# EAGLE design lf (EAGLE 5.11)
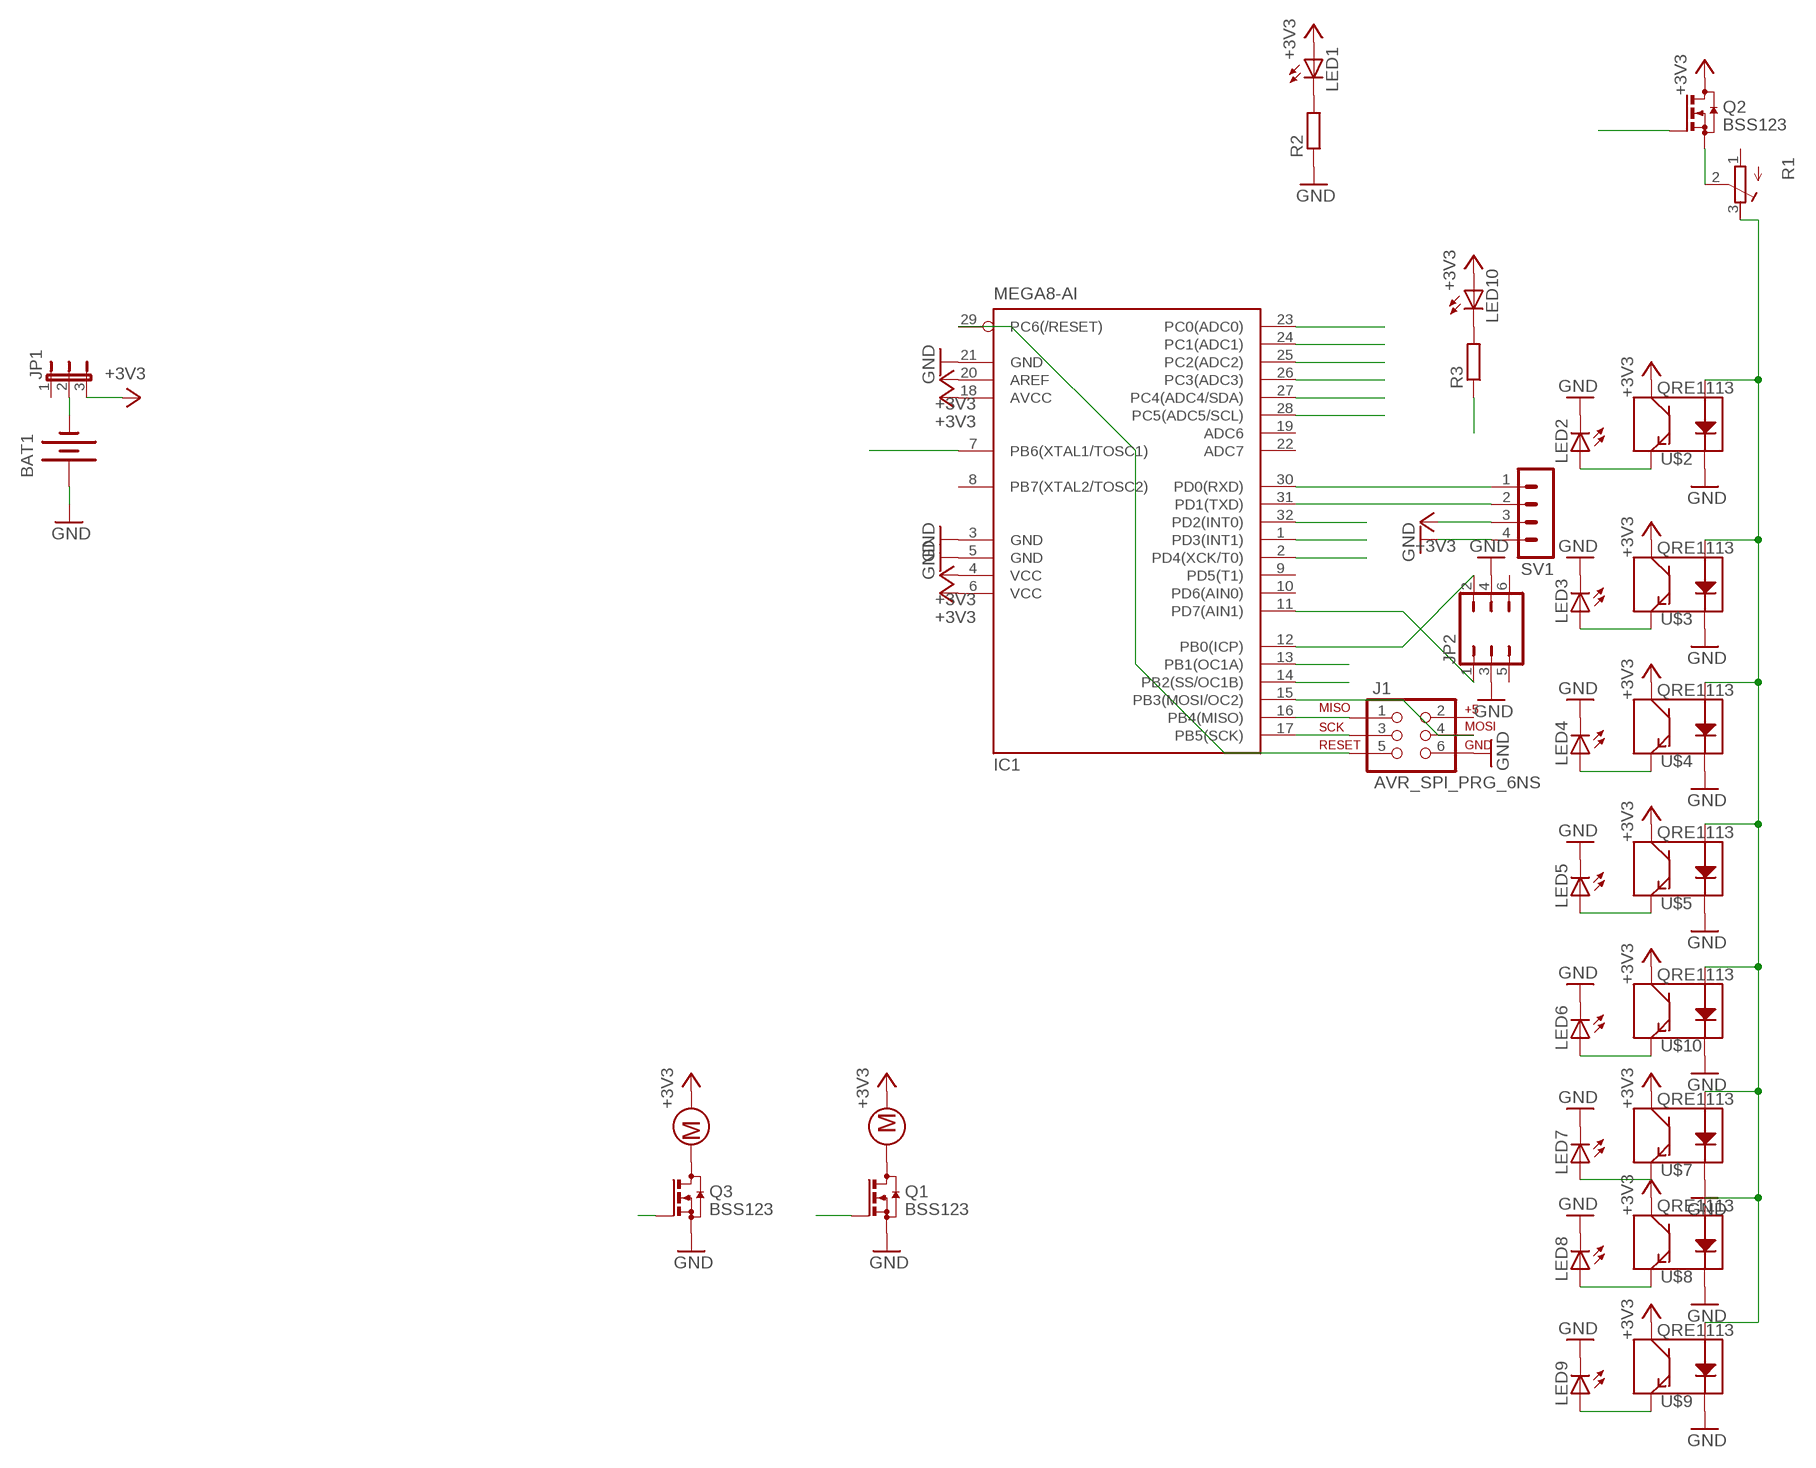
[diagram p0: schematic, sheet 1]

## Parts
BAT1  BATTERYFOB  [BATTERY_20MM_PTH_COMPACT]
IC1  MEGA8-AI  [TQFP32-08]
J1  AVR_SPI_PRG_6NS  [2X3-NS]
JP1  JP2E  [JP2]
JP2  JP3Q  [JP3Q]
LED1  LEDCHIPLED_1206  [CHIPLED_1206]
LED2  LEDCHIPLED_1206  [CHIPLED_1206]
LED3  LEDCHIPLED_1206  [CHIPLED_1206]
LED4  LEDCHIPLED_1206  [CHIPLED_1206]
LED5  LEDCHIPLED_1206  [CHIPLED_1206]
LED6  LEDCHIPLED_1206  [CHIPLED_1206]
LED7  LEDCHIPLED_1206  [CHIPLED_1206]
LED8  LEDCHIPLED_1206  [CHIPLED_1206]
LED9  LEDCHIPLED_1206  [CHIPLED_1206]
LED10  LEDCHIPLED_1206  [CHIPLED_1206]
Q1  BSS123  [SOT23]
Q2  BSS123  [SOT23]
Q3  BSS123  [SOT23]
R1  R-TRIMM3202  [RTRIM3202]
R2  R-EU_R0805  [R0805]
R3  R-EU_R0805  [R0805]
SV1  MA04-1  [MA04-1]
U$1  6MM-NANO-GEARMOTOR  [6MM-FUSE]
U$2  QRE1113  [QRE1113]
U$3  QRE1113  [QRE1113]
U$4  QRE1113  [QRE1113]
U$5  QRE1113  [QRE1113]
U$6  6MM-NANO-GEARMOTOR  [6MM-FUSE]
U$7  QRE1113  [QRE1113]
U$8  QRE1113  [QRE1113]
U$9  QRE1113  [QRE1113]
U$10  QRE1113  [QRE1113]

## Nets
+3V3: IC1.4(VCC) IC1.6(VCC) IC1.18(AVCC) IC1.20(AREF) JP1.3 LED1.A LED10.A Q2.3(D) SV1.3 U$1.P$5 U$2.3(C) U$3.3(C) U$4.3(C) U$5.3(C) U$6.P$6 U$7.3(C) U$8.3(C) U$9.3(C) U$10.3(C)
GND: BAT1.1(+) IC1.3(GND) IC1.5(GND) IC1.21(GND) J1.6 JP2.3 JP2.4 LED2.C LED3.C LED4.C LED5.C LED6.C LED7.C LED8.C LED9.C Q1.2(S) Q3.2(S) R2.1 SV1.4 U$2.2(K) U$3.2(K) U$4.2(K) U$5.2(K) U$7.2(K) U$8.2(K) U$9.2(K) U$10.2(K)
IR_LED: IC1.7(PB6(XTAL1/TOSC1)) Q2.1(G)
LED_STA: IC1.2(PD4(XCK/T0)) R3.1
M1: IC1.13(PB1(OC1A)) Q3.1(G)
M2: IC1.14(PB2(SS/OC1B)) Q1.1(G)
MISO: IC1.16(PB4(MISO)) J1.1
MOSI: IC1.15(PB3(MOSI/OC2)) J1.4
N$1: BAT1.2(-) JP1.2
N$2: IC1.30(PD0(RXD)) SV1.1
N$3: IC1.31(PD1(TXD)) SV1.2
N$4: Q3.3(D) U$1.P$6
N$5: Q1.3(D) U$6.P$5
N$6: LED1.C R2.2
N$7: IC1.12(PB0(ICP)) JP2.2
N$9: Q2.2(S) R1.2(S)
N$10: LED10.C R3.2
N$11: R1.3(A) U$2.1(A) U$3.1(A) U$4.1(A) U$5.1(A) U$7.1(A) U$8.1(A) U$9.1(A) U$10.1(A)
N$12: IC1.11(PD7(AIN1)) JP2.1
RESET: IC1.29(PC6(/RESET)) J1.5
S2: IC1.23(PC0(ADC0)) LED2.A U$2.4(E)
S3: IC1.24(PC1(ADC1)) LED3.A U$3.4(E)
S4: IC1.25(PC2(ADC2)) LED4.A U$4.4(E)
S5: IC1.26(PC3(ADC3)) LED5.A U$5.4(E)
S7: IC1.27(PC4(ADC4/SDA)) LED7.A U$7.4(E)
S8: IC1.28(PC5(ADC5/SCL)) LED8.A U$8.4(E)
S9: IC1.32(PD2(INT0)) LED9.A U$9.4(E)
S10: IC1.1(PD3(INT1)) LED6.A U$10.4(E)
SCK: IC1.17(PB5(SCK)) J1.3
Unconnected: IC1.8(PB7(XTAL2/TOSC2)) IC1.9(PD5(T1)) IC1.10(PD6(AIN0)) IC1.19(ADC6) IC1.22(ADC7) J1.2 JP1.1 JP2.5 JP2.6 R1.1(E)

## Library data of the parts
BAT1 = SparkFun:BATTERY: Battery Holders Various common sizes : AA, AAA, 20mm coin cell and 12mm coin cell.
IC1 = atmel:MEGA8: MICROCONTROLLER 8 Kbytes FLASH, 1 kbytes SRAM, 512 bytes EEPROM, USART, 6-channel 10 bit ADC, 2-channel 8 bit ADC Pin compatible with Atmega48, ATMega88, ATMega168 Source: avr.lbr; MPN: ATMEGA8-16AU; OC_FARNELL: 9171371; OC_NEWARK: 73M8863
J1 = AVR Header:AVR_SPI_PRG_6: AVR ISP 6 Pin This is the reduced ISP connector for AVR programming. Common on Arduino. This footprint will take up less PCB space and can be used with a 10-pin to 6-pin adapter such as SKU: BOB-08508
JP1 = jumper:JP2E: JUMPER
JP2 = jumper:JP3Q: JUMPER
LED1-LED10 = led:LED: LED OSRAM: - CHIPLED LG R971, LG N971, LY N971, LG Q971, LY Q971, LO R971, LY R971 LH N974, LH R974 LS Q976, LO Q976, LY Q976 LO Q996 - Hyper CHIPLED LW Q18S LB Q993, LB Q99A, LB R99A - SideLED LS A670, LO A670, LY A670, LG A670, LP A670 LB A673, LV A673, LT A673, LW A673 LH A674 LY A675 LS A676, LA A676, LO A676, LY A676, LW A676 LS A679, LY A679, LG A679 - Hyper Micro SIDELED® LS Y876, LA Y876, LO Y876, LY Y876 LT Y87S - SmartLED LW L88C, LW L88S LB L89C, LB L89S, LG L890 LS L89K, LO L89K, LY L89K LS L896, LA L896, LO L896, LY L896 - TOPLED LS T670, LO T670, LY T670, LG T670, LP T670 LSG T670, LSP T670, LSY T670, LOP T670, LYG T670 LG T671, LOG T671, LSG T671 LB T673, LV T673, LT T673, LW T673 LH T674 LS T676, LA T676, LO T676, LY T676, LB T676, LH T676, LSB T676, LW T676 LB T67C, LV T67C, LT T67C, LS T67K, LO T67K, LY T67K, LW E67C LS E67B, LA E67B, LO E67B, LY E67B, LB E67C, LV E67C, LT E67C LW T67C LS T679, LY T679, LG T679 LS T770, LO T770, LY T770, LG T770, LP T770 LB T773, LV T773, LT T773, LW T773 LH T774 LS E675, LA E675, LY E675, LS T675 LS T776, LA T776, LO T776, LY T776, LB T776 LHGB T686 LT T68C, LB T68C - Hyper Mini TOPLED® LB M676 - Mini TOPLED Santana® LG M470 LS M47K, LO M47K, LY M47K Source: http://www.osram.convergy.de LUXEON: - LUMILED® LXK2-PW12-R00, LXK2-PW12-S00, LXK2-PW14-U00, LXK2-PW14-V00 LXK2-PM12-R00, LXK2-PM12-S00, LXK2-PM14-U00 LXK2-PE12-Q00, LXK2-PE12-R00, LXK2-PE12-S00, LXK2-PE14-T00, LXK2-PE14-U00 LXK2-PB12-K00, LXK2-PB12-L00, LXK2-PB12-M00, LXK2-PB14-N00, LXK2-PB14-P00, LXK2-PB14-Q00 LXK2-PR12-L00, LXK2-PR12-M00, LXK2-PR14-Q00, LXK2-PR14-R00 LXK2-PD12-Q00, LXK2-PD12-R00, LXK2-PD12-S00 LXK2-PH12-R00, LXK2-PH12-S00 LXK2-PL12-P00, LXK2-PL12-Q00, LXK2-PL12-R00 Source: www.luxeon.com KINGBRIGHT: KA-3528ASYC Source: www.kingbright.com
Q1-Q3 = transistor-small-signal:BSS123: N-CHANNEL MOS FET
R1 = rcl:R-TRIMM: Trimm resistor
R2 R3 = rcl:R-EU_: RESISTOR, European symbol
SV1 = con-lstb:MA04-1: PIN HEADER; OC_FARNELL: unknown; OC_NEWARK: unknown
U$1 U$6 = PMD 6mm motor in fuse clip:6MM-NANO-GEARMOTOR
U$2-U$5 U$7-U$10 = SparkFun:QRE1113

## Board
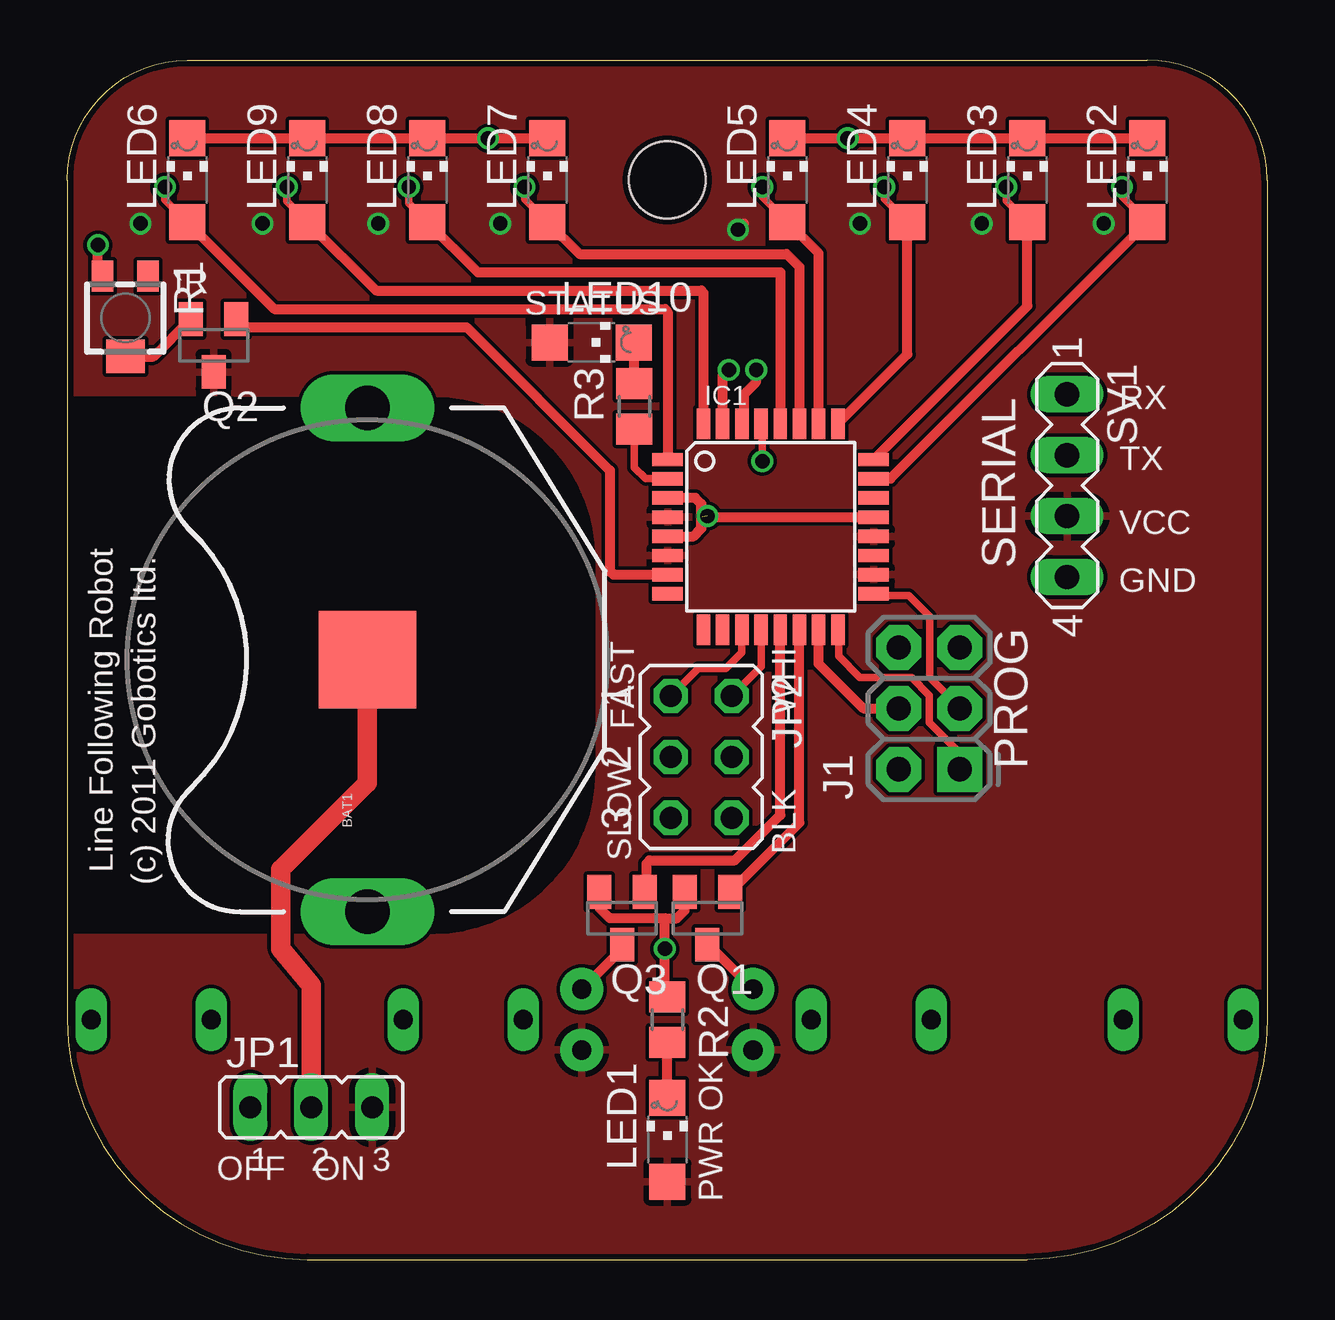
[diagram p1: board, top side]
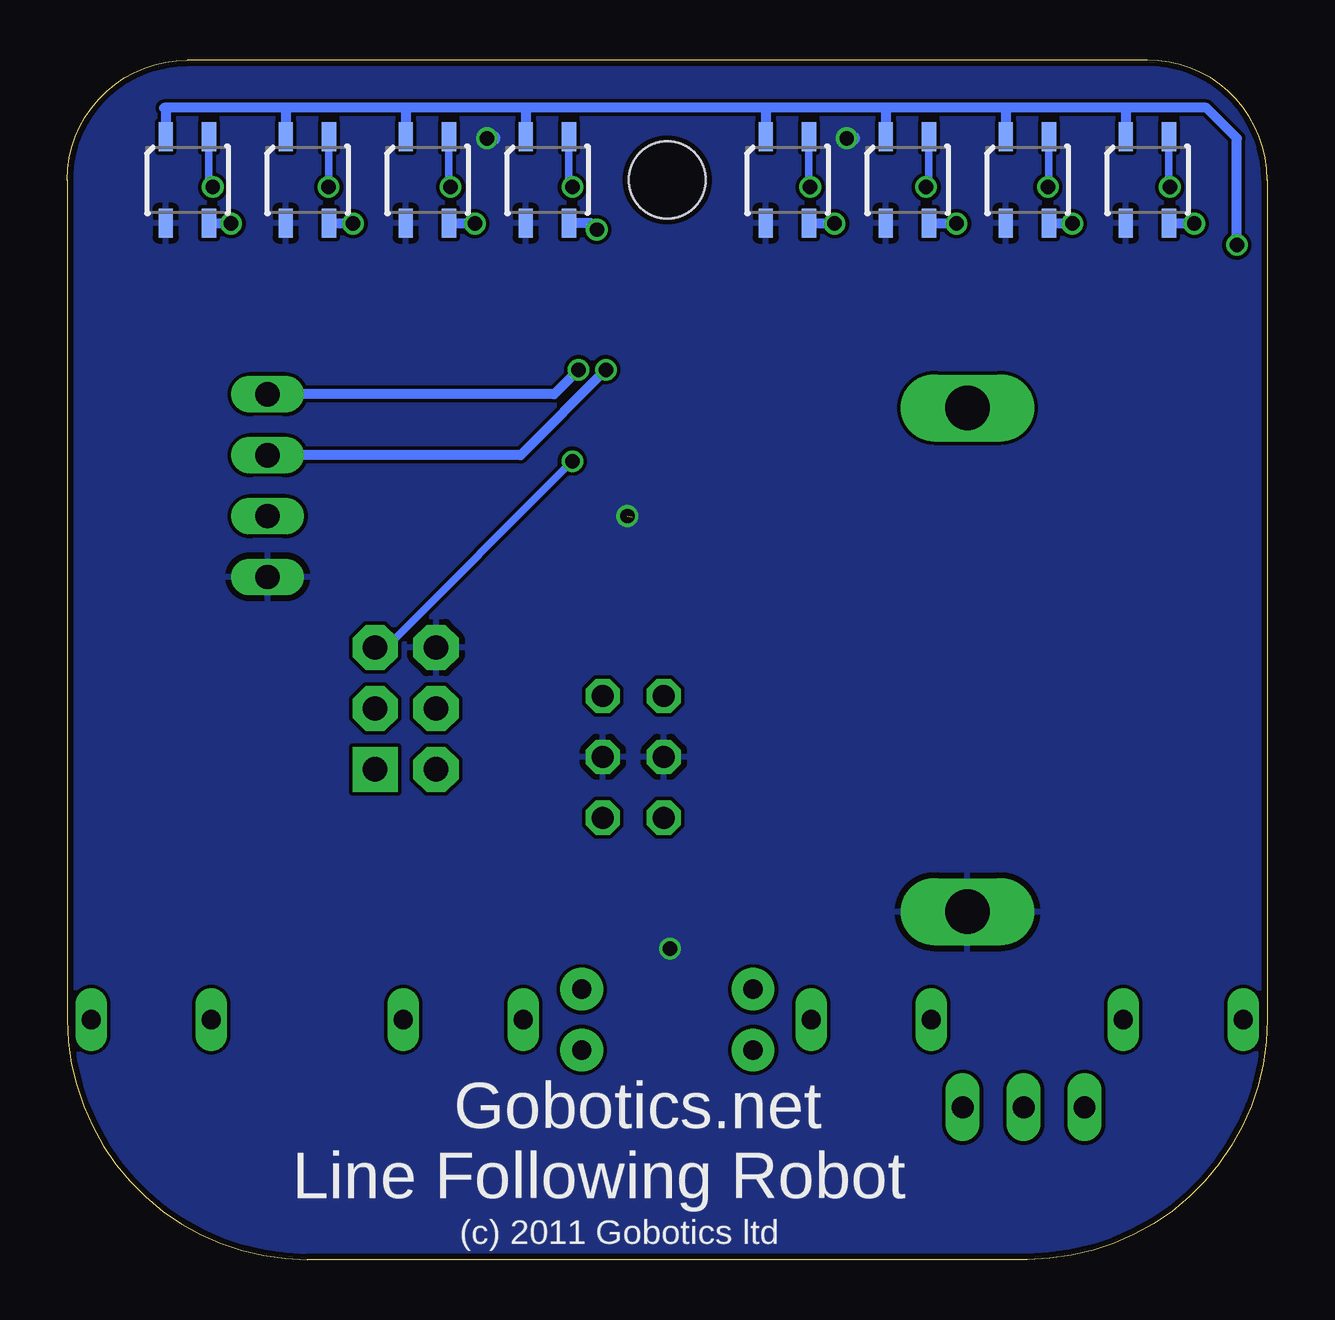
[diagram p2: board, bottom side, seen from below]

Size 50 x 50 mm. Coordinates in mm from the lower left corner, seen from the top.
Outline: 0,45 0,10 arc90 10,0 40,0 arc90 50,10 50,45 arc90 45,50 5,50 arc90 0,45
Copper layers (1*16): Top 0.035mm / dielectric 1.5mm / Bottom 0.035mm
Design rules "Seeed Fusion Design Rules": minimum track width 6mil, minimum drill 12mil, track to track 6mil, track to pad 6mil, pad to pad 6mil, via to via 6mil, smd to smd 0mil, copper to edge 10mil, drill to drill 10mil, minimum pad ring 10mil, minimum via ring 6mil, stop-mask expansion 2mil, vias tented up to drill 100mil, thermal gap 10mil
Holes 3.2 mm at 25,45
tRestrict: area -1.4,14 to 21.6,35.6

### Footprints (pad centres in the part's own frame; a part is rotated, then mirrored left to right if it is on the bottom)
BATTERY_20MM_PTH_COMPACT = drill 1.854 long: 1 -10.5,0; 3 10.5,0 | smd 4.064 x 4.064: 2 0,0
TQFP32-08 = smd 1.27 x 0.559: 1 -4.293,2.8; 2 -4.293,2; 3 -4.293,1.2; 4 -4.293,0.4; 5 -4.293,-0.4; 6 -4.293,-1.2; 7 -4.293,-2; 8 -4.293,-2.8; 17 4.293,-2.8; 18 4.293,-2; 19 4.293,-1.2; 20 4.293,-0.4; 21 4.293,0.4; 22 4.293,1.2; 23 4.293,2; 24 4.293,2.8 | smd 0.559 x 1.27: 9 -2.8,-4.293; 10 -2,-4.293; 11 -1.2,-4.293; 12 -0.4,-4.293; 13 0.4,-4.293; 14 1.2,-4.293; 15 2,-4.293; 16 2.8,-4.293; 25 2.8,4.293; 26 2,4.293; 27 1.2,4.293; 28 0.4,4.293; 29 -0.4,4.293; 30 -1.2,4.293; 31 -2,4.293; 32 -2.8,4.293
2X3-NS = drill 1.016 pad 1.88 square: 1 -2.54,-1.27 | drill 1.016 pad 1.88 octagon: 2 -2.54,1.27; 3 0,-1.27; 4 0,1.27; 5 2.54,-1.27; 6 2.54,1.27
JP2 = drill 0.914 long: 1 -2.54,0; 2 0,0; 3 2.54,0
JP3Q = drill 0.914 octagon: 1 -2.54,-1.27; 2 -2.54,1.27; 3 0,-1.27; 4 0,1.27; 5 2.54,-1.27; 6 2.54,1.27
CHIPLED_1206 = smd 1.5 x 1.5: A 0,-1.75; C 0,1.75
SOT23 = smd 1 x 1.4: 1 -0.95,-1.1; 2 0.95,-1.1; 3 0,1.1
RTRIM3202 = smd 0.9 x 1.3: 1 -0.95,-1.75; 3 0.95,-1.75 | smd 1.6 x 1.4: 2 0,1.6
R0805 = smd 1.3 x 1.5: 1 -0.95,0; 2 0.95,0
MA04-1 = drill 1.016 long: 1 -3.81,0; 2 -1.27,0; 3 1.27,0; 4 3.81,0
6MM-FUSE = drill 0.8 long: MOUNT1 -9,0; MOUNT2 -4,0; MOUNT3 4,0; MOUNT4 9,0 | drill 0.8 pad 1.778 round: P$5 -11.43,1.27; P$6 -11.43,-1.27
QRE1113 = smd 1.2 x 0.6: 1 -1.8,-0.9; 2 1.8,-0.9; 3 1.8,0.9; 4 -1.8,0.9

### Placement (x,y rotation side)
BAT1  12.5,25 90 top
IC1  29.3,30.54 0 top
J1  35.91,22.97 90 top
JP1  10.16,6.35 0 top
JP2  26.42,20.95 270 top
LED1  25,5 0 top
LED2  45,45 0 top
LED3  40,45 0 top
LED4  35,45 0 top
LED5  30,45 0 top
LED6  5,45 0 top
LED7  20,45 0 top
LED8  15,45 0 top
LED9  10,45 0 top
LED10  21.84,38.23 270 top
Q1  26.67,14.22 180 top
Q2  6.1,38.1 180 top
Q3  23.11,14.22 180 top
R1  2.41,39.24 180 top
R2  25,10 270 top
R3  23.62,35.56 90 top
SV1  41.66,32.26 270 top
U$1  10,10 180 top
U$2  45,45 270 bottom
U$3  40,45 270 bottom
U$4  35,45 270 bottom
U$5  30,45 270 bottom
U$6  40,10 0 top
U$7  20,45 270 bottom
U$8  15,45 270 bottom
U$9  10,45 270 bottom
U$10  5,45 270 bottom

### Tracks (layer width: path | path; a pad name or v marks a point on that pad's centre or on a via)
+3V3  (via drill 0.6)
  Top 0.406: v43.18,43.18 43.43,43.18 | v38.1,43.18 38.35,43.18 | v33.02,43.18 33.27,43.18 | v27.94,42.93 28.19,43.18 | v18.03,43.18 18.29,43.18 | v12.95,43.18 13.21,43.18 | v8.13,43.18 8.38,43.18 | v3.05,43.18 3.3,43.18
  Bottom 0.406: U$2.3 43.2,43.2 v43.18,43.18 | U$3.3 38.12,43.2 v38.1,43.18 | U$4.3 33.04,43.2 v33.02,43.18 | U$5.3 28.21,43.2 v27.94,42.93 | U$7.3 18.05,43.2 v18.03,43.18 | U$8.3 12.97,43.2 v12.95,43.18 | U$9.3 8.15,43.2 v8.13,43.18 | U$10.3 3.07,43.2 v3.05,43.18
  pour Top: -10,60 60,60 60,-10 -10,-10
GND  (via drill 0.6)  (1 unrouted)
  Top 0.406: LED6.C LED9.C LED8.C 17.51,46.75 | LED2.C LED3.C LED4.C 32.53,46.75 | LED5.C 32.5,46.75 | v17.54,46.75 LED7.C | IC1.3 26.17,31.74 26.42,31.5 26.42,30.99 | 26.42,30.99 26.42,30.48 26.08,30.14 IC1.5 | IC1.21 26.46,30.94 26.42,30.99 | Q1.2 25.72,14.54 25.4,14.22 24.89,14.22 | 24.89,14.22 v24.89,12.95 24.89,11.06 R2.1 | Q3.2 22.16,14.67 22.61,14.22 24.89,14.22
  Top 0.61: 32.5,46.75 v32.51,46.74 32.53,46.75 | 17.51,46.75 v17.53,46.74 v17.54,46.75
  Bottom 0.406: v24.89,12.95 24.89,13.21
  Bottom 0.61: v32.51,46.74 32.26,46.74 | v17.53,46.74 17.27,46.74
  other vias: 26.67,30.99
  pour Bottom: -20,70 70,70 70,-20 -20,-20
IR_LED
  Top 0.406: Q2.1 7.38,38.86 16.64,38.86 22.61,32.89 22.61,28.7 22.77,28.54 IC1.7
LED_STA
  Top 0.305: IC1.2 24.1,32.54 23.62,33.02 R3.1
M1
  Top 0.406: Q3.1 24.13,15.39 24.13,16.51 24.26,16.64 27.81,16.64 29.7,18.53 IC1.13
M2
  Top 0.406: IC1.14 30.5,18.21 Q1.1
MISO
  Top 0.305: J1.1 37.18,21.11 35.92,22.38 35.92,23.52 35.18,24.26 33.02,24.26 32.13,25.15 32.13,26.22 IC1.16
MOSI
  Top 0.406: J1.4 33.16,22.97 31.3,24.83 IC1.15
N$1
  Top 0.813: BAT1.2 12.5,19.87 8.89,16.26 8.89,12.95 10.16,11.43 JP1.2
N$2  (via drill 0.6)
  Top 0.305: 28.7,36.58 v28.7,37.08
  Top 0.406: IC1.30 28.19,34.93 28.19,36.07 28.7,36.58
  Bottom 0.406: v28.7,37.08 29.72,36.07 SV1.1
N$3  (via drill 0.6)
  Top 0.406: IC1.31 27.3,36.83 v27.56,37.08
  Bottom 0.406: v27.56,37.08 31.11,33.53 SV1.2
N$4
  Top 0.406: Q3.3 23.11,12.95 U$1.P$6
N$5
  Top 0.406: Q1.3 26.72,13.12 U$6.P$5
N$6
  Top 0.406: LED1.C R2.2
N$7
  Top 0.305: JP2.2 28.9,24.71 IC1.12
N$9
  Top 0.406: Q2.2 3.59,37.64 R1.2
N$10
  Top 0.406: LED10.C 23.62,38.2 R3.2
N$11  (via drill 0.6)
  Top 0.406: v1.27,42.29 1.27,41.19 R1.3
  Bottom 0.406: 35.81,48.01 40.89,48.01 | U$3.1 40.9,47.75 40.89,48.01 | U$4.1 35.9,47.92 35.81,48.01 | 10.92,48.01 16,48.01 | U$8.1 15.9,47.9 16,48.01 | U$9.1 10.9,47.98 10.92,48.01 | 16,48.01 20.83,48.01 | 20.83,48.01 30.99,48.01 | 30.99,48.01 35.81,48.01 | U$5.1 30.9,47.92 30.99,48.01 | U$7.1 20.9,47.93 20.83,48.01 | 40.89,48.01 45.97,48.01 45.9,47.93 U$2.1 | 5.97,48.01 2.54,48.01 1.27,46.74 v1.27,42.29 | 5.97,48.01 10.92,48.01 | U$10.1 5.9,47.94 5.97,48.01
N$12
  Top 0.305: JP2.1 26.29,24.64 27.43,24.64 28.1,25.31 IC1.11
RESET  (via drill 0.6)
  Top 0.305: v28.96,33.27 28.96,34.78 IC1.29
  Bottom 0.305: J1.5 36.72,25.51 v28.96,33.27
S2  (via drill 0.6)
  Top 0.305: v43.94,44.7 43.94,44.31 LED2.A
  Top 0.406: IC1.23 34.29,32.54 LED2.A
  Bottom 0.305: U$2.4 44.1,44.86 v43.94,44.7
S3  (via drill 0.6)
  Top 0.305: v39.12,44.7 39.12,44.13 LED3.A
  Top 0.406: LED3.A 40,39.75 IC1.24
  Bottom 0.305: U$3.4 39.1,44.72 v39.12,44.7
S4  (via drill 0.6)
  Top 0.305: v34.04,44.7 34.04,44.21 LED4.A
  Top 0.406: LED4.A 35,37.73 IC1.25
  Bottom 0.305: U$4.4 34.1,44.77 v34.04,44.7
S5  (via drill 0.6)
  Top 0.305: v28.96,44.7 28.96,44.29 LED5.A
  Top 0.406: LED5.A 31.3,41.95 IC1.26
  Bottom 0.305: U$5.4 29.1,44.85 v28.96,44.7
S7  (via drill 0.6)
  Top 0.305: v19.05,44.7 19.05,44.2 LED7.A
  Top 0.406: LED7.A 21.34,41.91 29.97,41.91 30.5,41.38 IC1.27
  Bottom 0.305: U$7.4 19.1,44.75 v19.05,44.7
S8  (via drill 0.6)
  Top 0.305: v14.22,44.7 14.22,44.03 LED8.A
  Top 0.406: LED8.A 17.1,41.15 29.72,41.15 29.7,41.13 IC1.28
  Bottom 0.305: U$8.4 14.1,44.83 v14.22,44.7
S9  (via drill 0.6)
  Top 0.305: v9.14,44.7 9.14,44.11 LED9.A
  Top 0.406: LED9.A 12.86,40.39 26.42,40.39 26.5,40.3 IC1.32
  Bottom 0.305: U$9.4 9.1,44.75 v9.14,44.7
S10  (via drill 0.6)
  Top 0.305: v4.06,44.7 4.06,44.19 LED6.A
  Top 0.406: LED6.A 8.63,39.62 24.89,39.62 25.01,39.51 IC1.1
  Bottom 0.305: U$10.4 4.1,44.74 v4.06,44.7
SCK
  Top 0.305: IC1.17 33.65,27.69 35.05,27.69 35.94,26.8 35.94,24.26 37.18,23.02 J1.3

### Text on the board
_tsilk: IR | STATUS | RX | TX | VCC | SERIAL | GND | WHI | FAST | PROG | SLOW | BLK | Line Following Robot | (c) 2011 Gobotics ltd. | OFF ON | PWR OK
_bsilk: Gobotics.net | Line Following Robot | (c) 2011 Gobotics ltd